# Altium project led-esp32.PrjPcb
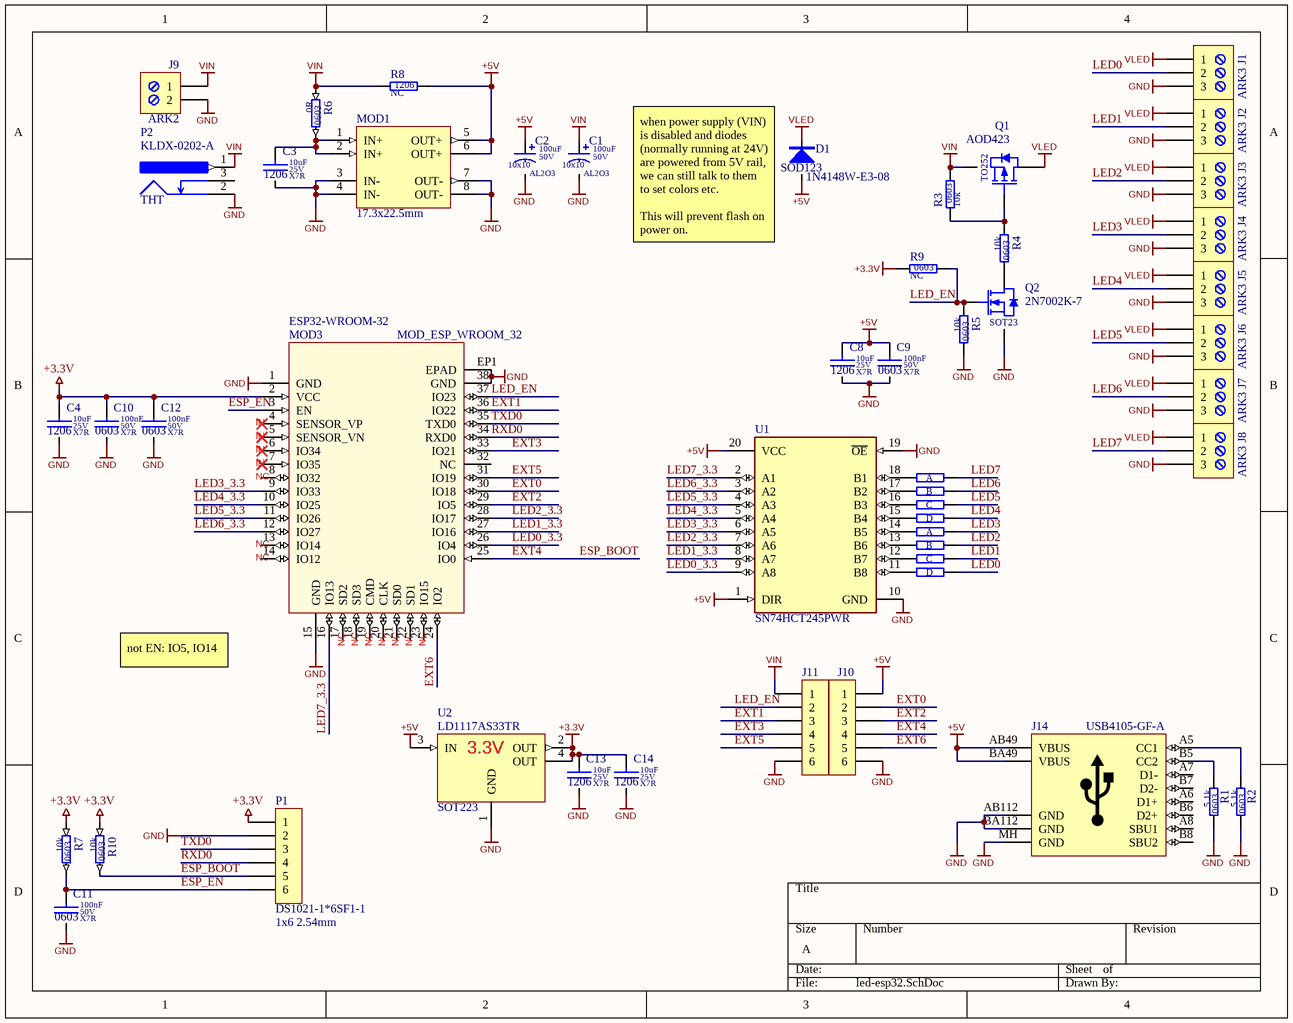
[diagram p0: led-esp32.SchDoc]
1 sheet, 44 parts. Net scope: global (net labels, ports and power ports of the same name join across sheets).
Board file: led-esp32.PcbDoc

## Sheet led-esp32.SchDoc
size A; SheetNumber: 1; SheetTotal: 1

### Parts
C1  value 100uF  Dielectric: AL2O3  SCH_Footprint: 10x10  Voltage: 50V  [CE_D_10x10_SMD]  (hidden comment: Electrolytic Capacitor)
C2  value 100uF  Dielectric: AL2O3  SCH_Footprint: 10x10  Voltage: 50V  [CE_D_10x10_SMD]  (hidden comment: Electrolytic Capacitor)
C3  value 10uF  Dielectric: X7R  Voltage: 25V  SCH_Footprint: 1206  [C_1206_3216]  (hidden comment: Ceramic X7R)
C4  value 10uF  Dielectric: X7R  Voltage: 25V  SCH_Footprint: 1206  [C_1206_3216]  (hidden comment: Ceramic X7R)
C8  value 10uF  Dielectric: X7R  Voltage: 25V  SCH_Footprint: 1206  [C_1206_3216]  (hidden comment: Ceramic X7R)
C9  value 100nF  Dielectric: X7R  Voltage: 50V  SCH_Footprint: 0603  [C_0603_1608]  (hidden comment: Ceramic X7R)
C10  value 100nF  Dielectric: X7R  Voltage: 50V  SCH_Footprint: 0603  [C_0603_1608]  (hidden comment: Ceramic X7R)
C11  value 100nF  Dielectric: X7R  Voltage: 50V  SCH_Footprint: 0603  [C_0603_1608]  (hidden comment: Ceramic X7R)
C12  value 100nF  Dielectric: X7R  Voltage: 50V  SCH_Footprint: 0603  [C_0603_1608]  (hidden comment: Ceramic X7R)
C13  value 10uF  Dielectric: X7R  Voltage: 25V  SCH_Footprint: 1206  [C_1206_3216]  (hidden comment: Ceramic X7R)
C14  value 10uF  Dielectric: X7R  Voltage: 25V  SCH_Footprint: 1206  [C_1206_3216]  (hidden comment: Ceramic X7R)
D1  value 1N4148W-E3-08  [SOD123]  (hidden comment: 1N4148W)
J1  ARK3  [J_ARK3]
J2  ARK3  [J_ARK3]
J3  ARK3  [J_ARK3]
J4  ARK3  [J_ARK3]
J5  ARK3  [J_ARK3]
J6  ARK3  [J_ARK3]
J7  ARK3  [J_ARK3]
J8  ARK3  [J_ARK3]
J9  ARK2  [J_ARK2]
J10  Goldpin female straight  [J_HEADER_1x6_2.54_VERTICAL]  (value not drawn)
J11  Goldpin female straight  [J_HEADER_1x6_2.54_VERTICAL]  (value not drawn)
J14  value USB4105-GF-A  [J_USB_C_USB4105]  (hidden comment: USB C Connector)
MOD1  SCH_Footprint: 17.3x22.5mm  [MOD_BUCK_MP1584]  (hidden comment: Low cost, Aliexpress-ready DC-DC buck converter using MP1584)
MOD3  value ESP32-WROOM-32  [MOD_ESP_WROOM_32]  (hidden comment: 2.4 GHz Wi-Fi-and-Bluetooth combo chip)
P1  value DS1021-1*6SF1-1  SCH_Footprint: 1x6 2.54mm  [P_HEADER_1x6_2.54]  (hidden comment: Goldpin)
P2  value KLDX-0202-A  SCH_Footprint: THT  [P_KLDX-0202-A]  (hidden comment: DC JACK)
Q1  SCH_Footprint: TO252  [DPAK_TO252-3_SC63_M]  (hidden comment: AOD423)
Q2  SCH_Footprint: SOT23  [SOT23_TO236_SC59]  (hidden comment: 2N7002K-7)
R1  value 5.1k  SCH_Footprint: 0603  [R_0603_1608]  (hidden comment: Resistor)
R2  value 5.1k  SCH_Footprint: 0603  [R_0603_1608]  (hidden comment: Resistor)
R3  value 10k  SCH_Footprint: 0603  [R_0603_1608]  (hidden comment: Resistor)
R4  value 10k  SCH_Footprint: 0603  [R_0603_1608]  (hidden comment: Resistor)
R5  value 10k  SCH_Footprint: 0603  [R_0603_1608]  (hidden comment: Resistor)
R6  value 0R  SCH_Footprint: 0603  [R_0603_1608]  (hidden comment: Resistor)
R7  value 10k  SCH_Footprint: 0603  [R_0603_1608]  (hidden comment: Resistor)
R8  value NC  SCH_Footprint: 1206  [R_NC_1206_3216]  (hidden comment: Resistor)
R9  value NC  SCH_Footprint: 0603  [R_NC_0603_1608]  (hidden comment: Resistor)
R10  value 10k  SCH_Footprint: 0603  [R_0603_1608]  (hidden comment: Resistor)
RN1  Resistors Network  [RN4_0804_2010]  (value not drawn)  (parts A,B,C,D of 4)
RN2  Resistors Network  [RN4_0804_2010]  (value not drawn)  (parts A,B,C,D of 4)
U1  SN74HCT245PWR  [FP-PW0020A-MFG]
U2  SCH_Footprint: SOT223  [SOT223_SC73]  (hidden comment: LD1117AS33TR)

### Nets
+3.3V: C4.1 C10.1 C12.1 C13.1 C14.1 MOD3.2(VCC) P1.1 R7.1 R9.1 R10.1 U2.2(OUT) U2.4(OUT)
+5V: C2.1 C8.1 C9.1 D1.2 J10.1 J14.AB49(VBUS) J14.BA49(VBUS) MOD1.5(OUT+) MOD1.6(OUT+) R8.2 U1.1(DIR) U1.20(VCC) U2.3(IN)
GND: C1.2 C2.2 C3.2 C4.2 C8.2 C9.2 C10.2 C11.2 C12.2 C13.2 C14.2 J1.3 J2.3 J3.3 J4.3 J5.3 J6.3 J7.3 J8.3 J9.2 J10.6 J11.6 J14.AB112(GND) J14.BA112(GND) J14.MH(GND) MOD1.3(IN-) MOD1.4(IN-) MOD1.7(OUT-) MOD1.8(OUT-) MOD3.1(GND) MOD3.15(GND) MOD3.38(GND) MOD3.EP1(EPAD) P1.2 P2.2 Q2.2(S) R1.2 R2.2 R5.2 U1.10(GND) U1.19(~{OE}) U2.1(GND)
VIN: C1.1 J9.1 J11.1 P2.1 Q1.3(S) R3.2 R6.1 R8.1
VLED: D1.1 J1.1 J2.1 J3.1 J4.1 J5.1 J6.1 J7.1 J8.1 Q1.2(D)
ESP_BOOT: J10.4 MOD3.25(IO0) P1.5 R10.2  [also labelled EXT4]
ESP_EN: C11.1 MOD3.3(EN) P1.6 R7.2
EXT0: J10.2 MOD3.30(IO18)
EXT1: J11.3 MOD3.36(IO22)
EXT2: J10.3 MOD3.29(IO5)
EXT3: J11.4 MOD3.33(IO21)
EXT5: J11.5 MOD3.31(IO19)
EXT6: J10.5 MOD3.24(IO2)
LED0: J1.2 RN2.5
LED0_3.3: MOD3.26(IO4) U1.9(A8)
LED1: J2.2 RN2.6
LED1_3.3: MOD3.27(IO16) U1.8(A7)
LED2: J3.2 RN2.7
LED2_3.3: MOD3.28(IO17) U1.7(A6)
LED3: J4.2 RN2.8
LED3_3.3: MOD3.9(IO33) U1.6(A5)
LED4: J5.2 RN1.5
LED4_3.3: MOD3.10(IO25) U1.5(A4)
LED5: J6.2 RN1.6
LED5_3.3: MOD3.11(IO26) U1.4(A3)
LED6: J7.2 RN1.7
LED6_3.3: MOD3.12(IO27) U1.3(A2)
LED7: J8.2 RN1.8
LED7_3.3: MOD3.16(IO13) U1.2(A1)
LED_EN: J11.2 MOD3.37(IO23) Q2.1(G) R5.1 R9.2
RXD0: MOD3.34(RXD0) P1.4
TXD0: MOD3.35(TXD0) P1.3
NetC3_1: C3.1 MOD1.1(IN+) MOD1.2(IN+) R6.2
NetJ14_A5: J14.A5(CC1) R2.1
NetJ14_B5: J14.B5(CC2) R1.1
NetQ1_1: Q1.1(G) R3.1 R4.1
NetQ2_3: Q2.3(D) R4.2
NetRN1_1: RN1.1 U1.18(B1)
NetRN1_2: RN1.2 U1.17(B2)
NetRN1_3: RN1.3 U1.16(B3)
NetRN1_4: RN1.4 U1.15(B4)
NetRN2_1: RN2.1 U1.14(B5)
NetRN2_2: RN2.2 U1.13(B6)
NetRN2_3: RN2.3 U1.12(B7)
NetRN2_4: RN2.4 U1.11(B8)

Not connected (* = marked no-connect by the designer): J14 A6(D1+) A7(D1-) A8(SBU1) B6(D2+) B7(D2-) B8(SBU2); MOD3 4(SENSOR_VP)* 5(SENSOR_VN)* 6(IO34)* 7(IO35)* 8(IO32) 13(IO14) 14(IO12) 17(SD2) 18(SD3) 19(CMD) 20(CLK) 21(SD0) 22(SD1) 23(IO15) 32(NC); P2 3

### Notes on the sheet
- (near D1) when power supply (VIN) is disabled and diodes (normally running at 24V) are powered from 5V rail, we can still talk to them to set colors etc.
  This will prevent flash on power on.
- (near MOD3) IN
- (near MOD3) NC
- not EN: IO5, IO14
- (in symbol RN4_120R_0804_5, part A) A
- (in symbol RN4_120R_0804_5, part B) B
- (in symbol RN4_120R_0804_5, part C) C
- (in symbol RN4_120R_0804_5, part D) D

### Library data of the parts
C1 C2 = CE_100uF_50V_AL2O3_10x10_20: Polarized Capacitor; Manufacturer: Nichicon; Manufacturer Part Number: UUX1H101MNL1GS; Tolerance (%): 20; Part Number: CE_100uF_50V_AL2O3_10x10_20; HelpURL: https://datasheet.octopart.com/UUX1H101MNL1GS-Nichicon-datasheet-62047998.pdf; Supplier 1: TME; Supplier Part Number 1: UUX1H101MNL1GS; Supplier 2: RS Components; Supplier Part Number 2: 7393107; Supplier 3: Farnell; Supplier Part Number 3: 2841943; Supplier 4: Mouser; Supplier Part Number 4: 647-UUX1H101MNL1GS; Supplier 5: Digi-Key; Supplier Part Number 5: 493-6269-1-ND; Supplier 6: LCSC
C3 C4 C8 C13 C14 = C_10uF_25V_X7R_1206_10: Capacitor; Manufacturer: Samsung; Manufacturer Part Number: CL31B106KAHNNNE; Tolerance (%): 10; Part Number: C_10uF_25V_X7R_1206_10; HelpURL: http://www.tme.eu/pl/Document/4a42202b32dab16128fe107dd69598cc/samsung-chip-cap.pdf; Supplier 1: TME; Supplier Part Number 1: CL31B106KAHNNNE; Supplier 2: RS Components; Supplier Part Number 2: 766-6773; Supplier 3: Farnell; Supplier Part Number 3: 3013526; Supplier 4: Mouser; Supplier Part Number 4: 187-CL31B106KAHNNNE; Supplier 5: Digi-Key; Supplier Part Number 5: 1276-1804-1-ND; Supplier 6: LCSC
C9-C12 = C_100nF_50V_X7R_0603_5: Capacitor; Manufacturer: Samsung; Manufacturer Part Number: CL10B104JB8NNNC; Tolerance (%): 5; Part Number: C_100nF_50V_X7R_0603_5; HelpURL: http://www.tme.eu/pl/Document/4a42202b32dab16128fe107dd69598cc/samsung-chip-cap.pdf; Supplier 1: TME; Supplier Part Number 1: CL10B104JB8NNNC; Supplier 2: RS Components; Supplier Part Number 2: 7665455; Supplier 3: Farnell; Supplier 4: Mouser; Supplier 5: Digi-Key; Supplier Part Number 5: 1276-1033-1-ND; Supplier 6: LCSC; Supplier Part Number 6: C24452
D1 = D_1N4148W_0A15_75V_SOD123: Manufacturer: Vishay; Voltage: 75; Current: 0.15A; SCH_Footprint: SOD123; Part Number: D_1N4148W_0A15_75V_SOD123; HelpURL: https://datasheet.octopart.com/1N4148W-E3-08-Vishay-datasheet-17291302.pdf; Manufacturer Part Number: 1N4148W-E3-08; Supplier 1: TME; Supplier Part Number 1: 1N4148W-E3-08; Supplier 2: RS Components; Supplier Part Number 2: 7003671; Supplier 3: Farnell; Supplier Part Number 3: 2433353; Supplier 4: Mouser; Supplier Part Number 4: 78-1N4148W-E3-08; Supplier 5: Digi-Key; Supplier Part Number 5: 1N4148W-E3-08CT-ND; Supplier 6: LCSC
J1-J8 = J_TB-5.0-P-3P: ARK Screw terminal, 3-Pin; Manufacturer: DEGSON ELECTRONICS; Value: DG301-5.0-03P-12-18A(H); SCH_Footprint: ARK3; Part Number: J_TB-5.0-P-3P; HelpURL: https://datasheet.octopart.com/DG301-5.0-03P-12-18A%28H%29-Degson-datasheet-17801202.pdf; Manufacturer Part Number: DG301-5.0-03P-12-18A(H); Supplier 1: TME; Supplier Part Number 1: DG301-5.0-3/6B; Supplier 2: RS Components; Supplier 3: Farnell; Supplier 4: Mouser; Supplier 5: Digi-Key; Supplier 6: LCSC
J9 = J_TB-5.0-P-2P: ARK Screw terminal, 2-Pin; Manufacturer: DEGSON ELECTRONICS; Value: DG301-5.0-02P-12-18A(H); SCH_Footprint: ARK2; Part Number: J_TB-5.0-P-2P; HelpURL: https://datasheet.octopart.com/DG301-5.0-03P-12-18A%28H%29-Degson-datasheet-17801202.pdf; Manufacturer Part Number: DG301-5.0-02P-12-18A(H); Supplier 1: TME; Supplier Part Number 1: DG301-5.0-2/6B; Supplier 2: RS Components; Supplier 3: Farnell; Supplier 4: Mouser; Supplier 5: Digi-Key; Supplier 6: LCSC
J10 J11 = J_HEADER_1x6_2.54_VERTICAL: Pin Header; Manufacturer: Connfly; SCH_Footprint: 1x6 2.54mm Vertical; Value: DS1023-1*6S21; Part Number: J_HEADER_1x6_2.54_VERTICAL; HelpURL: https://www.tme.eu/Document/584b1a60cf2e8809a936c5f5ff2de0d5/zl262-sg.pdf; Manufacturer Part Number: DS1023-1*6S21; Supplier 1: TME; Supplier Part Number 1: ZL262-6SG; Supplier 2: RS Components; Supplier 3: Farnell; Supplier 4: Mouser; Supplier 5: Digi-Key; Supplier 6: LCSC
J14 = J_USB_C_USB4105-GF-A: Manufacturer: GCT; SCH_Footprint: SMD; Part Number: J_USB_C_USB4105-GF-A; HelpURL: https://www.mouser.pl/datasheet/2/837/USB4105-2888174.pdf; Manufacturer Part Number: USB4105-GF-A; Supplier 1: TME; Supplier 2: RS Components; Supplier 3: Farnell; Supplier Part Number 3: 3588205; Supplier 4: Mouser; Supplier Part Number 4: 640-USB4105-GF-A; Supplier 5: Digi-Key; Supplier Part Number 5: 2073-USB4105-GF-ACT-ND; Supplier 6: LCSC
MOD1 = MOD_BUCK_MP1584: Value: -; Part Number: MOD_BUCK_MP1584; HelpURL: https://pl.aliexpress.com/item/32341006065.html; Manufacturer: -; Manufacturer Part Number: -; Supplier 1: TME; Supplier 2: RS Components; Supplier 3: Farnell; Supplier 4: Mouser; Supplier 5: Digi-Key; Supplier 6: LCSC; Supplier 7: -; Supplier Part Number 7: -
MOD3 = MOD_ESP32-WROOM-32: Manufacturer: ESPRESSIF; SCH_Footprint: MOD_ESP_WROOM_32; Part Number: MOD_ESP32-WROOM-32; HelpURL: https://www.espressif.com/sites/default/files/documentation/esp32_datasheet_en.pdf; Manufacturer Part Number: ESP32-WROOM-32; Supplier 1: TME; Supplier Part Number 1: ESP32-WROOM-32; Supplier 2: RS Components; Supplier Part Number 2: 169-7594; Supplier 3: Farnell; Supplier 4: Mouser; Supplier Part Number 4: 356-ESP-WROOM-32; Supplier 5: Digi-Key; Supplier Part Number 5: 1904-1010-1-ND; Supplier 6: LCSC
P1 = P_HEADER_1x6_2.54: Pin Header; Manufacturer: Connfly; Part Number: P_HEADER_1x6_2.54; HelpURL: http://www.tme.eu/en/Document/cc301e58a5da78cb543a94b5a5b7f06a/DS1021.pdf; Manufacturer Part Number: DS1021-1*6SF1-1; Supplier 1: TME; Supplier Part Number 1: ZL201-06G; Supplier 2: RS Components; Supplier 3: Farnell; Supplier 4: Mouser; Supplier 5: Digi-Key; Supplier 6: LCSC
P2 = P_KLDX-0202-A: Typical 3-pin jack power connector with switch; Manufacturer: Kycon; Part Number: P_KLDX-0202-A; HelpURL: http://www.kycon.com/2013Catalogpage/DC%20Power/KLDX_0202.pdf; Manufacturer Part Number: KLDX-0202-A; Supplier 1: TME; Supplier 2: RS Components; Supplier 3: Farnell; Supplier Part Number 3: 2839850; Supplier 4: Mouser; Supplier Part Number 4: 806-KLDX-0202-A; Supplier 5: Digi-Key; Supplier Part Number 5: 2092-KLDX-0202-A-ND; Supplier 6: LCSC
Q1 = QP_AOD423: Manufacturer: Alpha&Omega Semiconductor; Type: P-MOS; Voltage: 30V; Current: 67A; Value: AOD423; Part Number: QP_AOD423; HelpURL: https://www.aosmd.com/sites/default/files/res/datasheets/AOI423.pdf; Manufacturer Part Number: AOD423; Supplier 1: TME; Supplier Part Number 1: AOD423; Supplier 2: RS Components; Supplier 3: Farnell; Supplier 4: Mouser; Supplier 5: Digi-Key; Supplier 6: LCSC
Q2 = QN_2N7002K-7: Manufacturer: Diodes Inc; Type: N-MOS; Voltage: 60V; Current: 0A8; Value: 2N7002K-7; Part Number: QN_2N7002K-7; HelpURL: http://datasheet.octopart.com/2N7002K-7-Diodes-Inc.-datasheet-12515815.pdf; Manufacturer Part Number: 2N7002K-7; Supplier 1: TME; Supplier 2: RS Components; Supplier Part Number 2: 7703383; Supplier 3: Farnell; Supplier Part Number 3: 1713825; Supplier 4: Mouser; Supplier Part Number 4: 621-2N7002K-7; Supplier 5: Digi-Key; Supplier Part Number 5: 2N7002K-7DICT-ND; Supplier 6: LCSC
R1 R2 = R_5.1k_0603_1: Manufacturer: Yageo; Manufacturer Part Number: RC0603FR-135K1L; Voltage: 75V; Power: 100mW; Tolerance: 1%; Part Number: R_5.1k_0603_1; HelpURL: https://octopart.com/datasheet/rc0603fr-135k1l-yageo-25911767; Supplier 1: TME; Supplier 2: RS Components; Supplier 3: Farnell; Supplier 4: Mouser; Supplier Part Number 4: 603-RC0603FR-135K1L; Supplier 5: Digi-Key; Supplier Part Number 5: 13-RC0603FR-135K1LCT-ND; Supplier 6: LCSC
R3-R5 = R_10k_0603_1: Manufacturer: Vishay; Manufacturer Part Number: CRCW060310K0FKTA; Voltage: 75V; Power: 100mW; Tolerance: 1%; Part Number: R_10k_0603_1; HelpURL: https://octopart.com/datasheet/crcw060310k0fkta-vishay-39447548; Supplier 1: TME; Supplier Part Number 1: CRCW060310K0FKTABC; Supplier 2: RS Components; Supplier 3: Farnell; Supplier Part Number 3: 1652827; Supplier 4: Mouser; Supplier Part Number 4: 71-CRCW0603-10K; Supplier 5: Digi-Key; Supplier Part Number 5: 541-2980-1-ND; Supplier 6: LCSC
R6 = R_0R_0603_1: Manufacturer: Yageo; Manufacturer Part Number: RC0603FR-070RL; Voltage: 75V; Power: 100mW; Tolerance: 1%; Part Number: R_0R_0603_1; HelpURL: https://datasheet.octopart.com/RC0603FR-070RL-Yageo-datasheet-8328172.pdf; Supplier 1: TME; Supplier Part Number 1: RC0603FR-070RL; Supplier 2: RS Components; Supplier 3: Farnell; Supplier Part Number 3: 2309106; Supplier 4: Mouser; Supplier Part Number 4: 603-RC0603FR-070RL; Supplier 5: Digi-Key; Supplier Part Number 5: 311-0.0HRCT-ND; Supplier 6: LCSC; Supplier Part Number 6: C100044
R7 R10 = R_10k_0603_1_AECQ0: Manufacturer: Panasonic; Manufacturer Part Number: ERJ-3EKF1002V; Voltage: 75V; Power: 100mW; Tolerance: 1%; AEC-Q: 0; Part Number: R_10k_0603_1_AECQ0; HelpURL: https://industrial.panasonic.com/cdbs/www-data/pdf/RDA0000/AOA0000C304.pdf; Supplier 1: TME; Supplier Part Number 1: ERJ3EKF1002V; Supplier 2: RS Components; Supplier 3: Farnell; Supplier Part Number 3: 2303192; Supplier 4: Mouser; Supplier Part Number 4: 667-ERJ-3EKF1002V; Supplier 5: Digi-Key; Supplier Part Number 5: P10.0KHCT-ND; Supplier 6: LCSC; Supplier Part Number 6: C191124
R8 = R_GENERIC_1206: Part Number: R_GENERIC_1206; HelpURL: -; Manufacturer: -; Manufacturer Part Number: -; Supplier 1: TME; Supplier 2: RS Components; Supplier 3: Farnell; Supplier 4: Mouser; Supplier 5: Digi-Key; Supplier 6: LCSC
R9 = R_GENERIC_0603: Part Number: R_GENERIC_0603; HelpURL: -; Manufacturer: -; Manufacturer Part Number: -; Supplier 1: TME; Supplier 2: RS Components; Supplier 3: Farnell; Supplier 4: Mouser; Supplier 5: Digi-Key; Supplier 6: LCSC
RN1 RN2 = RN4_120R_0804_5: Manufacturer: Panasonic; Manufacturer Part Number: EXB-28V121JX; SCH_Footprint: 0804; Value: 120R; Voltage: 50V; Power: 63mW; Tolerance: 5%; Part Number: RN4_120R_0804_5; HelpURL: http://industrial.panasonic.com/cdbs/www-data/pdf/AOC0000/AOC0000C14.pdf; Supplier 1: TME; Supplier 2: RS Components; Supplier 3: Farnell; Supplier Part Number 3: 2060045; Supplier 4: Mouser; Supplier Part Number 4: 667-EXB-28V121JX; Supplier 5: Digi-Key; Supplier Part Number 5: Y7121CT-ND; Supplier 6: LCSC
U1 = CMP-1620-00542-3: IC TXRX NON-INVERT 5.5V 20TSSOP; Number of Circuits: 8; Propagation Delay: 74ns; Operating Supply Voltage: 5V; Logic Function: Transceiver; Quiescent Current: 8uA; Min Supply Voltage: 4.5V; Direction: Bidirectional; Number of Elements: 1; High Level Output Current: -6mA; Polarity: Non-Inverting; Low Level Output Current: 6mA; Number of Bits per Element: 8; Max Supply Voltage: 5.5V; Mount: Surface Mount; Package Quantity: 2000; Number of Pins: 20; Turn-On Delay Time: 74ns; Number of Bits: 8; Radiation Hardening: No; Contact Plating: Gold; Packaging: Tape and Reel; Case/Package: TSSOP; Lead Free: Lead Free; Min Operating Temperature: -40°C; Weight: 0.002716oz; Number of Channels: 8; Max Operating Temperature: 85°C; Number of Outputs: 8; REACH SVHC: No SVHC
U2 = VL_LD1117AS33TR_3V3_1A2: typical configuration; Manufacturer: STMicroelectronics; Voltage: 3.3V; Current: 1.2A; Value: LD1117AS33TR; Part Number: VL_LD1117AS33TR_3V3_1A2; HelpURL: http://www.tme.eu/pl/Document/bad00e7fc591b73ff810af309b2bb7a4/LD1117A.pdf; Manufacturer Part Number: LD1117AS33TR; Supplier 1: TME; Supplier Part Number 1: LD1117AS33; Supplier 2: RS Components; Supplier 3: Farnell; Supplier Part Number 3: 1467776; Supplier 4: Mouser; Supplier Part Number 4: LD1117AS33; Supplier 5: Digi-Key; Supplier Part Number 5: 497-1228-1-ND; Supplier 6: LCSC

## Assembly variants
+24V: not fitted J14 R1 R2 R8
USB: not fitted C3 D1 J9 MOD1 P2 R6; alternate parts R8 -> R_0R_1206_5